# EAGLE schematic V3.1_Radio Stack Breakout System v40 (EAGLE 9.7.0)
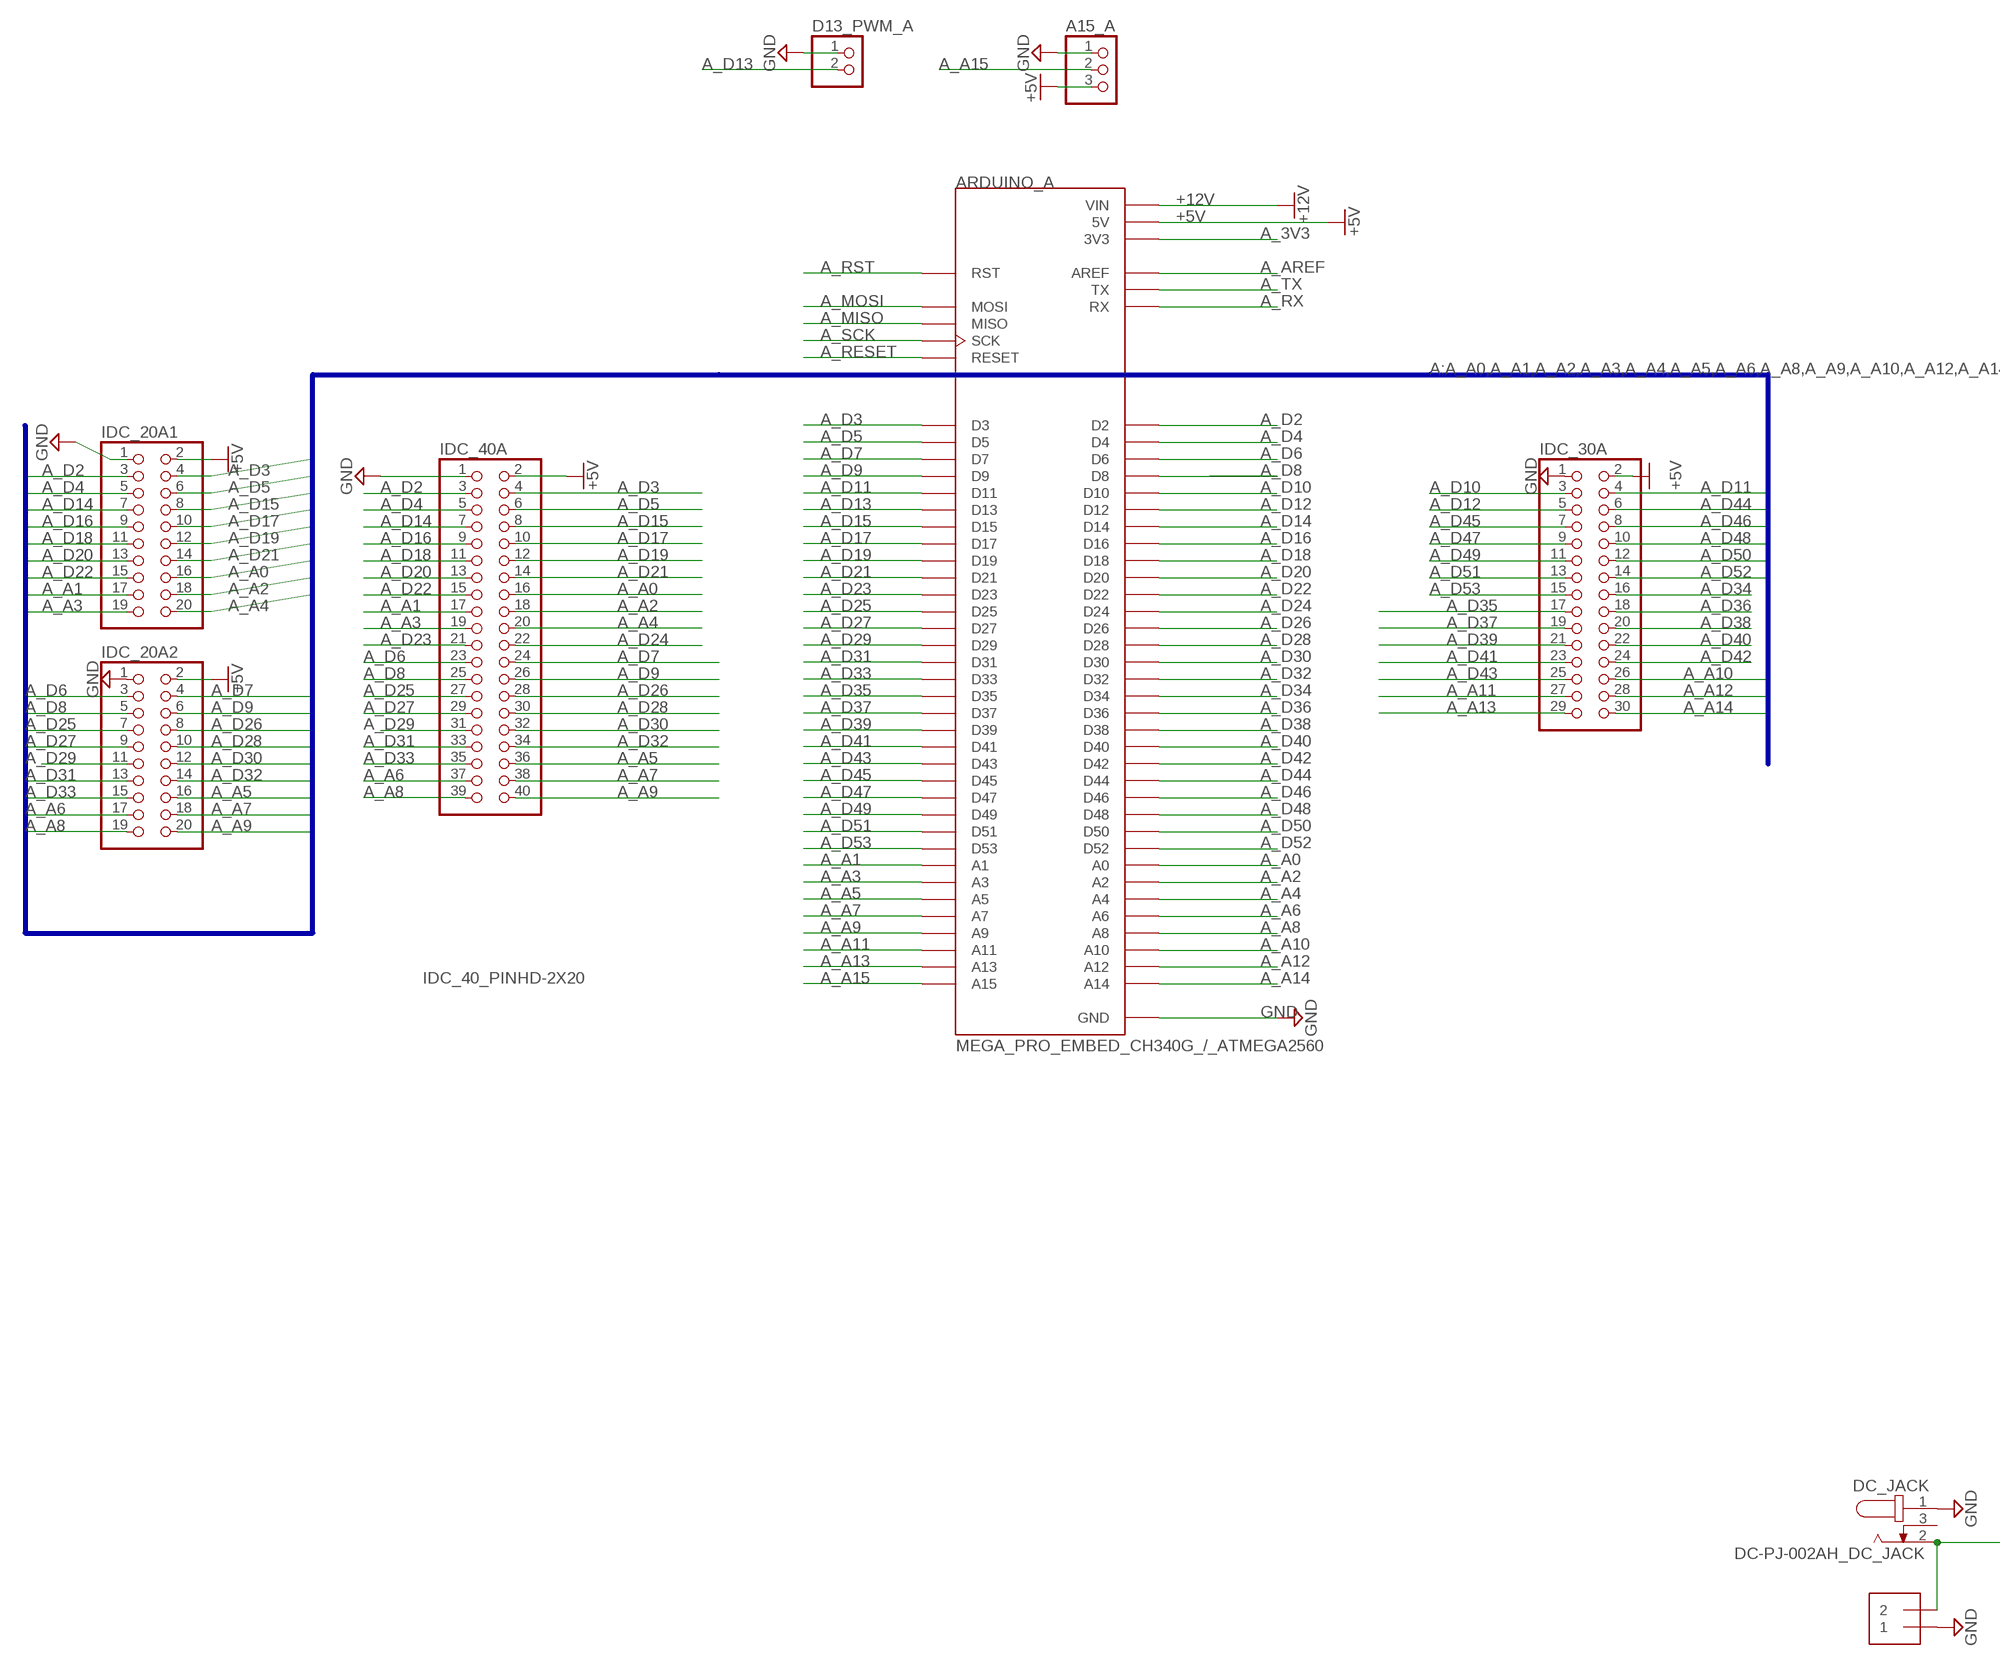
[diagram p0: schematic, sheet 1, part 1 of 2]
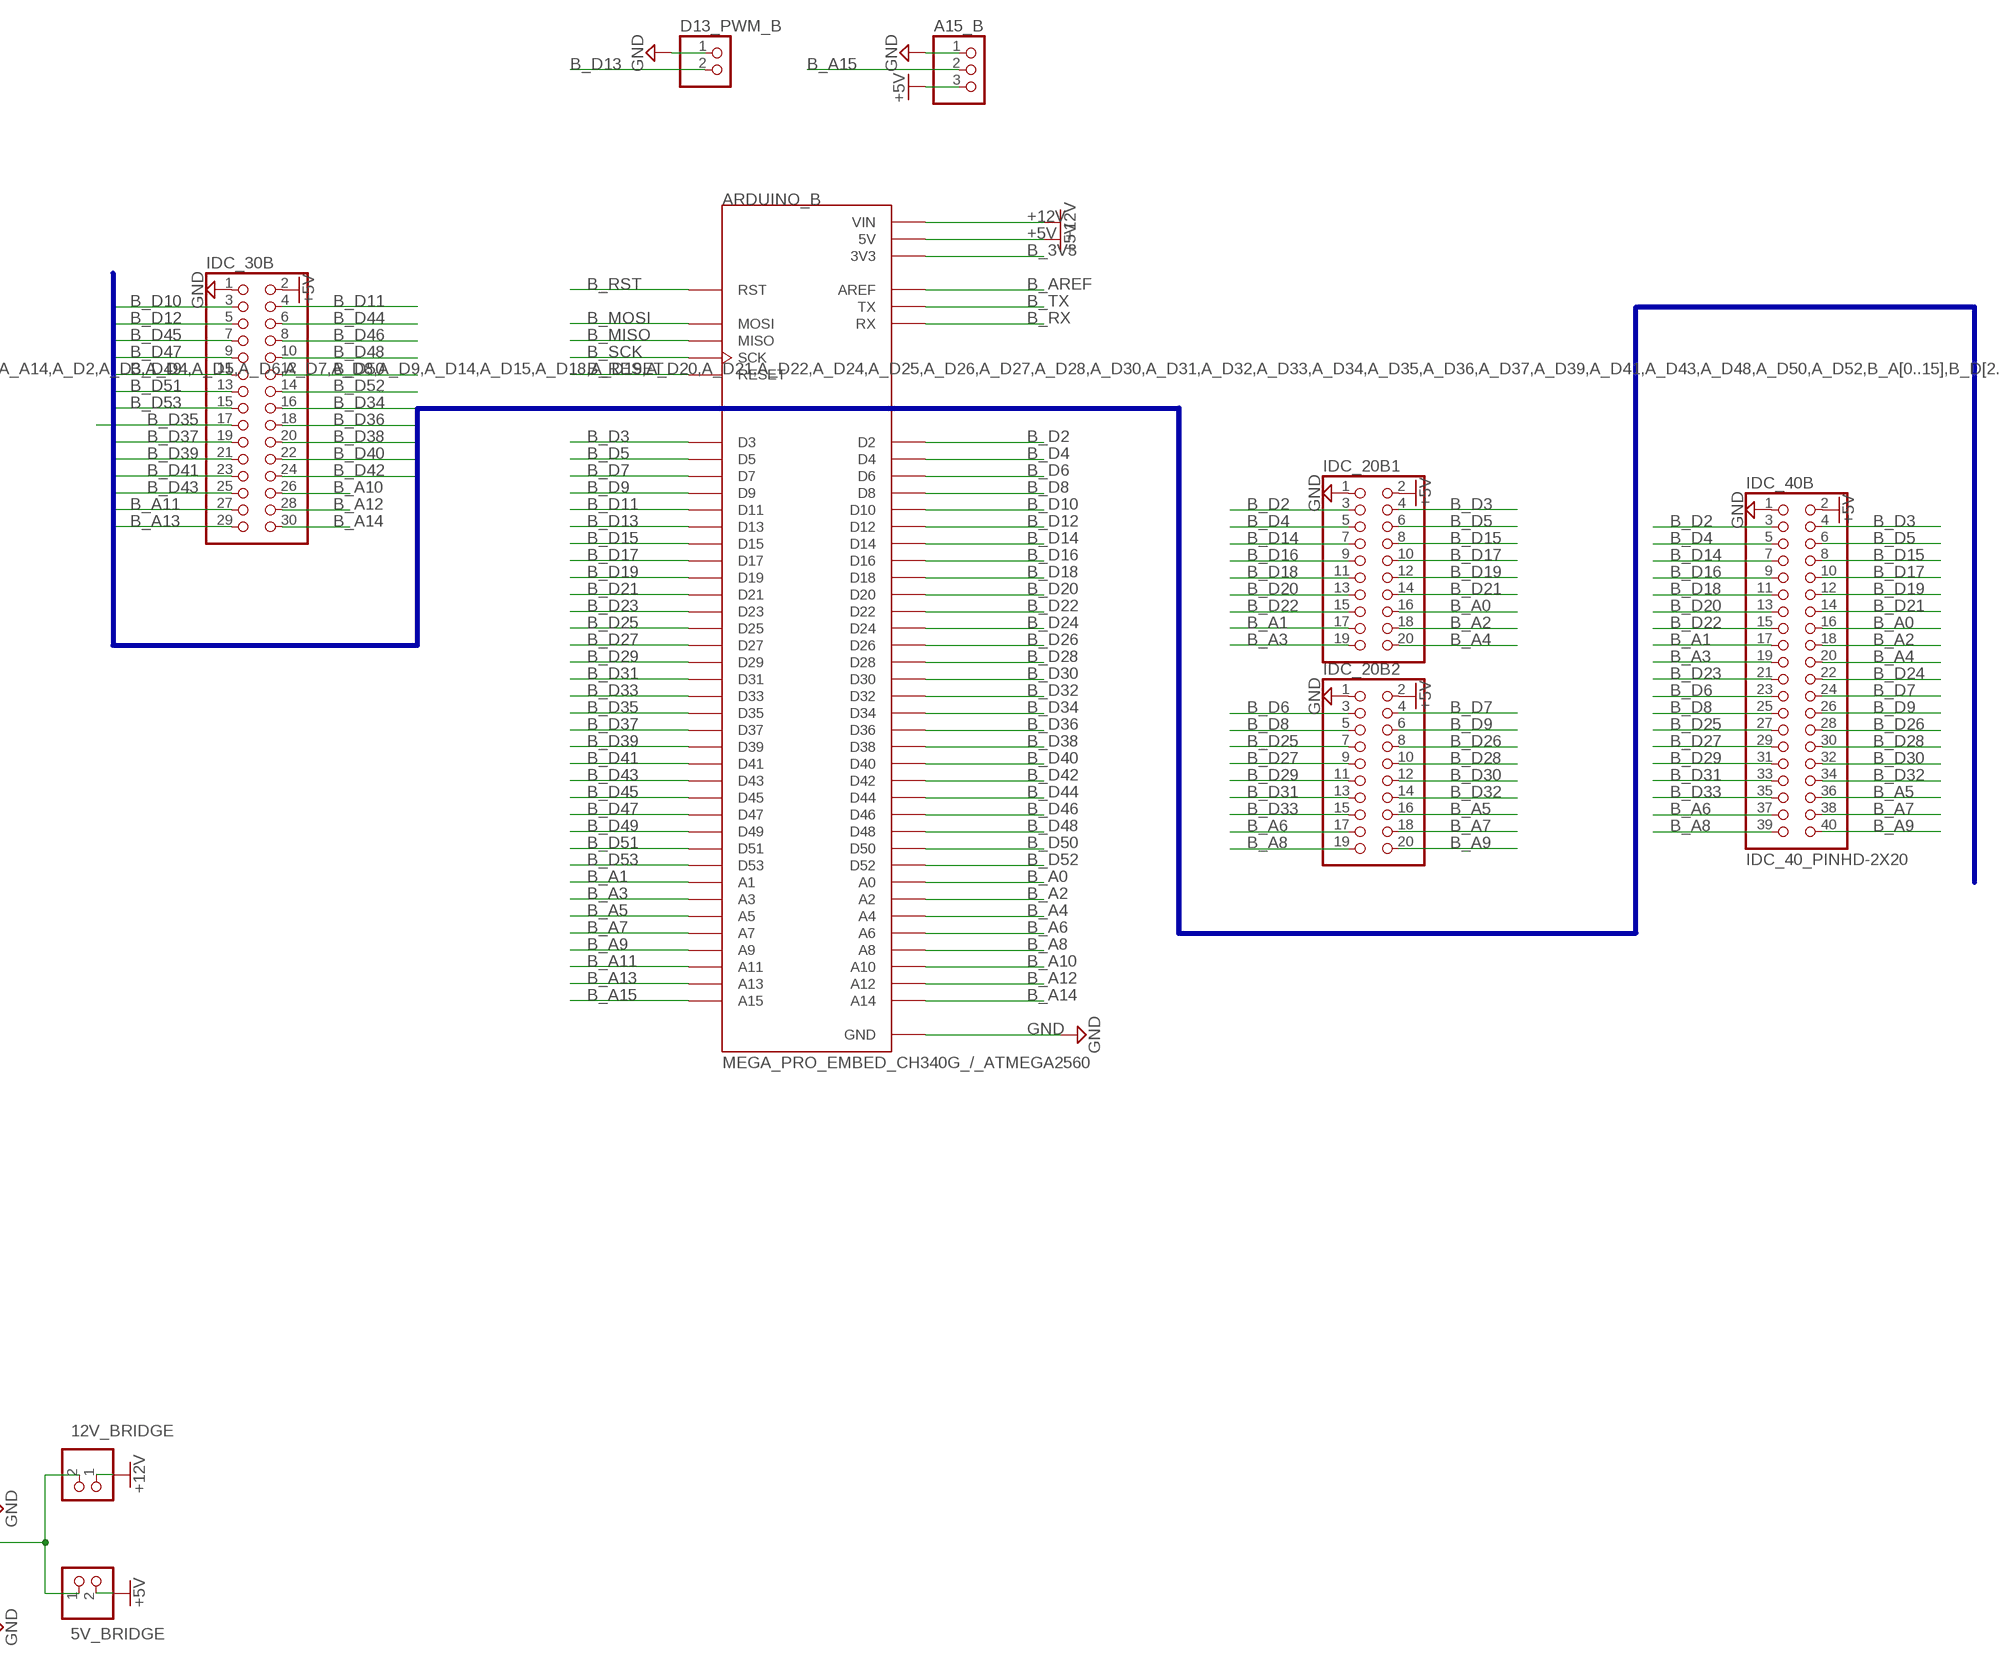
[diagram p1: schematic, sheet 1, part 2 of 2]

## Parts
5V_BRIDGE  PINHD-1X2  [1X02]
12V_BRIDGE  PINHD-1X2  [1X02]
A15_A  PINHD-1X3  [1X03]
A15_B  PINHD-1X3  [1X03]
ARDUINO_A  MEGA_PRO_EMBED_CH340G_/_ATMEGA2560  [MODULE_MEGA_PRO_EMBED_CH340G_/_ATMEGA2560]
ARDUINO_B  MEGA_PRO_EMBED_CH340G_/_ATMEGA2560  [MODULE_MEGA_PRO_EMBED_CH340G_/_ATMEGA2560]
D13_PWM_A  PINHD-1X2  [1X02]
D13_PWM_B  PINHD-1X2  [1X02]
DC_JACK  DC-PJ-002AH_DC_JACK  [CUI_PJ-002AH]
IDC_20A1  IDC_20_PINHD-2X10  [2X10]
IDC_20A2  IDC_20_PINHD-2X10  [2X10]
IDC_20B1  IDC_20_PINHD-2X10  [2X10]
IDC_20B2  IDC_20_PINHD-2X10  [2X10]
IDC_30A  IDC_30_PINHD-2X15  [2X15_IDC_30]
IDC_30B  IDC_30_PINHD-2X15  [2X15_IDC_30]
IDC_40A  IDC_40_PINHD-2X20  [IDC_40_2X20]
IDC_40B  IDC_40_PINHD-2X20  [IDC_40_2X20]
POWER  2.54MMAND5.08MM_SCREW_TERMINAL2.54&5.08  [1X2_2.54&5.08MM]

## Nets
+5V: 5V_BRIDGE.2 A15_A.3 A15_B.3 ARDUINO_A.5V_1(5V) ARDUINO_A.5V_2(5V) ARDUINO_A.5V_3(5V) ARDUINO_B.5V_1(5V) ARDUINO_B.5V_2(5V) ARDUINO_B.5V_3(5V) IDC_20A1.2 IDC_20A2.2 IDC_20B1.2 IDC_20B2.2 IDC_30A.2 IDC_30B.2 IDC_40A.2 IDC_40B.2
+12V: 12V_BRIDGE.1 ARDUINO_A.VIN_1(VIN) ARDUINO_A.VIN_2(VIN) ARDUINO_B.VIN_1(VIN) ARDUINO_B.VIN_2(VIN)
A_3V3: ARDUINO_A.3V3_1(3V3) ARDUINO_A.3V3_2(3V3)
A_A0: ARDUINO_A.A0 IDC_20A1.16 IDC_40A.16
A_A1: ARDUINO_A.A1 IDC_20A1.17 IDC_40A.17
A_A2: ARDUINO_A.A2 IDC_20A1.18 IDC_40A.18
A_A3: ARDUINO_A.A3 IDC_20A1.19 IDC_40A.19
A_A4: ARDUINO_A.A4 IDC_20A1.20 IDC_40A.20
A_A5: ARDUINO_A.A5 IDC_20A2.16 IDC_40A.36
A_A6: ARDUINO_A.A6 IDC_20A2.17 IDC_40A.37
A_A7: ARDUINO_A.A7 IDC_20A2.18 IDC_40A.38
A_A8: ARDUINO_A.A8 IDC_20A2.19 IDC_40A.39
A_A9: ARDUINO_A.A9 IDC_20A2.20 IDC_40A.40
A_A10: ARDUINO_A.A10 IDC_30A.26
A_A11: ARDUINO_A.A11 IDC_30A.27
A_A12: ARDUINO_A.A12 IDC_30A.28
A_A13: ARDUINO_A.A13 IDC_30A.29
A_A14: ARDUINO_A.A14 IDC_30A.30
A_A15: A15_A.2 ARDUINO_A.A15
A_AREF: ARDUINO_A.AREF
A_D2: ARDUINO_A.D2 IDC_20A1.3 IDC_40A.3
A_D3: ARDUINO_A.D3 IDC_20A1.4 IDC_40A.4
A_D4: ARDUINO_A.D4 IDC_20A1.5 IDC_40A.5
A_D5: ARDUINO_A.D5 IDC_20A1.6 IDC_40A.6
A_D6: ARDUINO_A.D6 IDC_20A2.3 IDC_40A.23
A_D7: ARDUINO_A.D7 IDC_20A2.4 IDC_40A.24
A_D8: ARDUINO_A.D8 IDC_20A2.5 IDC_40A.25
A_D9: ARDUINO_A.D9 IDC_20A2.6 IDC_40A.26
A_D10: ARDUINO_A.D10 IDC_30A.3
A_D11: ARDUINO_A.D11 IDC_30A.4
A_D12: ARDUINO_A.D12 IDC_30A.5
A_D13: ARDUINO_A.D13 D13_PWM_A.2
A_D14: ARDUINO_A.D14 IDC_20A1.7 IDC_40A.7
A_D15: ARDUINO_A.D15 IDC_20A1.8 IDC_40A.8
A_D16: ARDUINO_A.D16 IDC_20A1.9 IDC_40A.9
A_D17: ARDUINO_A.D17 IDC_20A1.10 IDC_40A.10
A_D18: ARDUINO_A.D18 IDC_20A1.11 IDC_40A.11
A_D19: ARDUINO_A.D19 IDC_20A1.12 IDC_40A.12
A_D20: ARDUINO_A.D20 IDC_20A1.13 IDC_40A.13
A_D21: ARDUINO_A.D21 IDC_20A1.14 IDC_40A.14
A_D22: ARDUINO_A.D22 IDC_20A1.15 IDC_40A.15
A_D23: ARDUINO_A.D23 IDC_40A.21
A_D24: ARDUINO_A.D24 IDC_40A.22
A_D25: ARDUINO_A.D25 IDC_20A2.7 IDC_40A.27
A_D26: ARDUINO_A.D26 IDC_20A2.8 IDC_40A.28
A_D27: ARDUINO_A.D27 IDC_20A2.9 IDC_40A.29
A_D28: ARDUINO_A.D28 IDC_20A2.10 IDC_40A.30
A_D29: ARDUINO_A.D29 IDC_20A2.11 IDC_40A.31
A_D30: ARDUINO_A.D30 IDC_20A2.12 IDC_40A.32
A_D31: ARDUINO_A.D31 IDC_20A2.13 IDC_40A.33
A_D32: ARDUINO_A.D32 IDC_20A2.14 IDC_40A.34
A_D33: ARDUINO_A.D33 IDC_20A2.15 IDC_40A.35
A_D34: ARDUINO_A.D34 IDC_30A.16
A_D35: ARDUINO_A.D35 IDC_30A.17
A_D36: ARDUINO_A.D36 IDC_30A.18
A_D37: ARDUINO_A.D37 IDC_30A.19
A_D38: ARDUINO_A.D38 IDC_30A.20
A_D39: ARDUINO_A.D39 IDC_30A.21
A_D40: ARDUINO_A.D40 IDC_30A.22
A_D41: ARDUINO_A.D41 IDC_30A.23
A_D42: ARDUINO_A.D42 IDC_30A.24
A_D43: ARDUINO_A.D43 IDC_30A.25
A_D44: ARDUINO_A.D44 IDC_30A.6
A_D45: ARDUINO_A.D45 IDC_30A.7
A_D46: ARDUINO_A.D46 IDC_30A.8
A_D47: ARDUINO_A.D47 IDC_30A.9
A_D48: ARDUINO_A.D48 IDC_30A.10
A_D49: ARDUINO_A.D49 IDC_30A.11
A_D50: ARDUINO_A.D50 IDC_30A.12
A_D51: ARDUINO_A.D51 IDC_30A.13
A_D52: ARDUINO_A.D52 IDC_30A.14
A_D53: ARDUINO_A.D53 IDC_30A.15
A_MISO: ARDUINO_A.MISO
A_MOSI: ARDUINO_A.MOSI
A_RESET: ARDUINO_A.RESET
A_RST: ARDUINO_A.RST
A_RX: ARDUINO_A.RX
A_SCK: ARDUINO_A.SCK
A_TX: ARDUINO_A.TX
B_3V3: ARDUINO_B.3V3_1(3V3) ARDUINO_B.3V3_2(3V3)
B_A0: ARDUINO_B.A0 IDC_20B1.16 IDC_40B.16
B_A1: ARDUINO_B.A1 IDC_20B1.17 IDC_40B.17
B_A2: ARDUINO_B.A2 IDC_20B1.18 IDC_40B.18
B_A3: ARDUINO_B.A3 IDC_20B1.19 IDC_40B.19
B_A4: ARDUINO_B.A4 IDC_20B1.20 IDC_40B.20
B_A5: ARDUINO_B.A5 IDC_20B2.16 IDC_40B.36
B_A6: ARDUINO_B.A6 IDC_20B2.17 IDC_40B.37
B_A7: ARDUINO_B.A7 IDC_20B2.18 IDC_40B.38
B_A8: ARDUINO_B.A8 IDC_20B2.19 IDC_40B.39
B_A9: ARDUINO_B.A9 IDC_20B2.20 IDC_40B.40
B_A10: ARDUINO_B.A10 IDC_30B.26
B_A11: ARDUINO_B.A11 IDC_30B.27
B_A12: ARDUINO_B.A12 IDC_30B.28
B_A13: ARDUINO_B.A13 IDC_30B.29
B_A14: ARDUINO_B.A14 IDC_30B.30
B_A15: A15_B.2 ARDUINO_B.A15
B_AREF: ARDUINO_B.AREF
B_D2: ARDUINO_B.D2 IDC_20B1.3 IDC_40B.3
B_D3: ARDUINO_B.D3 IDC_20B1.4 IDC_40B.4
B_D4: ARDUINO_B.D4 IDC_20B1.5 IDC_40B.5
B_D5: ARDUINO_B.D5 IDC_20B1.6 IDC_40B.6
B_D6: ARDUINO_B.D6 IDC_20B2.3 IDC_40B.23
B_D7: ARDUINO_B.D7 IDC_20B2.4 IDC_40B.24
B_D8: ARDUINO_B.D8 IDC_20B2.5 IDC_40B.25
B_D9: ARDUINO_B.D9 IDC_20B2.6 IDC_40B.26
B_D10: ARDUINO_B.D10 IDC_30B.3
B_D11: ARDUINO_B.D11 IDC_30B.4
B_D12: ARDUINO_B.D12 IDC_30B.5
B_D13: ARDUINO_B.D13 D13_PWM_B.2
B_D14: ARDUINO_B.D14 IDC_20B1.7 IDC_40B.7
B_D15: ARDUINO_B.D15 IDC_20B1.8 IDC_40B.8
B_D16: ARDUINO_B.D16 IDC_20B1.9 IDC_40B.9
B_D17: ARDUINO_B.D17 IDC_20B1.10 IDC_40B.10
B_D18: ARDUINO_B.D18 IDC_20B1.11 IDC_40B.11
B_D19: ARDUINO_B.D19 IDC_20B1.12 IDC_40B.12
B_D20: ARDUINO_B.D20 IDC_20B1.13 IDC_40B.13
B_D21: ARDUINO_B.D21 IDC_20B1.14 IDC_40B.14
B_D22: ARDUINO_B.D22 IDC_20B1.15 IDC_40B.15
B_D23: ARDUINO_B.D23 IDC_40B.21
B_D24: ARDUINO_B.D24 IDC_40B.22
B_D25: ARDUINO_B.D25 IDC_20B2.7 IDC_40B.27
B_D26: ARDUINO_B.D26 IDC_20B2.8 IDC_40B.28
B_D27: ARDUINO_B.D27 IDC_20B2.9 IDC_40B.29
B_D28: ARDUINO_B.D28 IDC_20B2.10 IDC_40B.30
B_D29: ARDUINO_B.D29 IDC_20B2.11 IDC_40B.31
B_D30: ARDUINO_B.D30 IDC_20B2.12 IDC_40B.32
B_D31: ARDUINO_B.D31 IDC_20B2.13 IDC_40B.33
B_D32: ARDUINO_B.D32 IDC_20B2.14 IDC_40B.34
B_D33: ARDUINO_B.D33 IDC_20B2.15 IDC_40B.35
B_D34: ARDUINO_B.D34 IDC_30B.16
B_D35: ARDUINO_B.D35 IDC_30B.17
B_D36: ARDUINO_B.D36 IDC_30B.18
B_D37: ARDUINO_B.D37 IDC_30B.19
B_D38: ARDUINO_B.D38 IDC_30B.20
B_D39: ARDUINO_B.D39 IDC_30B.21
B_D40: ARDUINO_B.D40 IDC_30B.22
B_D41: ARDUINO_B.D41 IDC_30B.23
B_D42: ARDUINO_B.D42 IDC_30B.24
B_D43: ARDUINO_B.D43 IDC_30B.25
B_D44: ARDUINO_B.D44 IDC_30B.6
B_D45: ARDUINO_B.D45 IDC_30B.7
B_D46: ARDUINO_B.D46 IDC_30B.8
B_D47: ARDUINO_B.D47 IDC_30B.9
B_D48: ARDUINO_B.D48 IDC_30B.10
B_D49: ARDUINO_B.D49 IDC_30B.11
B_D50: ARDUINO_B.D50 IDC_30B.12
B_D51: ARDUINO_B.D51 IDC_30B.13
B_D52: ARDUINO_B.D52 IDC_30B.14
B_D53: ARDUINO_B.D53 IDC_30B.15
B_MISO: ARDUINO_B.MISO
B_MOSI: ARDUINO_B.MOSI
B_RESET: ARDUINO_B.RESET
B_RST: ARDUINO_B.RST
B_RX: ARDUINO_B.RX
B_SCK: ARDUINO_B.SCK
B_TX: ARDUINO_B.TX
GND: A15_A.1 A15_B.1 ARDUINO_A.GND_1(GND) ARDUINO_A.GND_2(GND) ARDUINO_A.GND_3(GND) ARDUINO_B.GND_1(GND) ARDUINO_B.GND_2(GND) ARDUINO_B.GND_3(GND) D13_PWM_A.1 D13_PWM_B.1 DC_JACK.1 IDC_20A1.1 IDC_20A2.1 IDC_20B1.1 IDC_20B2.1 IDC_30A.1 IDC_30B.1 IDC_40A.1 IDC_40B.1 POWER.1 POWER.P$1
N$2: 5V_BRIDGE.1 12V_BRIDGE.2 DC_JACK.2 POWER.2 POWER.P$2
Unconnected: DC_JACK.3

## Buses
A:A_A0,A_A1,A_A2,A_A3,A_A4,A_A5,A_A6,A_A8,A_A9,A_A10,A_A12,A_A14,A_D2,A_D3,A_D4,A_D5,A_D6,A_D7,A_D8,A_D9,A_D14,A_D15,A_D18,A_D19,A_D20,A_D21,A_D22,A_D24,A_D25,A_D26,A_D27,A_D28,A_D30,A_D31,A_D32,A_D33,A_D34,A_D35,A_D36,A_D37,A_D39,A_D41,A_D43,A_D48,A_D50,A_D52,B_A[0..15],B_D[2..53]

## Library data of the parts
5V_BRIDGE 12V_BRIDGE D13_PWM_A D13_PWM_B = pinhead:PINHD-1X2: PIN HEADER
A15_A A15_B = pinhead:PINHD-1X3: PIN HEADER
ARDUINO_A ARDUINO_B = SnapEDA Library:MEGA_PRO_EMBED_CH340G_/_ATMEGA2560: Mega 2560 PRO (Embed) CH340G/ATmega2560-16AU; MANUFACTURER: Robotdyn; PARTREV: 12/May/2017; STANDARD: Manufacturer Recommendations
DC_JACK = CaptainBobSim Library, custom:DC-PJ-002AH_DC_JACK: 2.0 mm Center Pin, 5.0 A, Right Angle, Through Hole, Dc Power Jack Connector; MANUFACTURER: CUI INC; STANDARD: Manufacturer recommendations
IDC_20A1 IDC_20A2 IDC_20B1 IDC_20B2 = CaptainBobSim Library, custom:IDC_20_PINHD-2X10: PIN HEADER
IDC_30A IDC_30B = CaptainBobSim Library, custom:IDC_30_PINHD-2X15: PIN HEADER
IDC_40A IDC_40B = CaptainBobSim Library, custom:IDC_40_PINHD-2X20: PIN HEADER; CATEGORY: Headers; DESCRIPTION: Header, Straight, 2x20 Position; MANUFACTURER: Generic; MPN: Generic; OPERATING_TEMPERATURE: Generic; PART_STATUS: Active; PITCH: 0.100" (2.54mm); ROHS_COMPLIANCE: Generic; SERIES: Generic; SUB-CATEGORY: Headers, Male Pins; TYPE: Board to Board or Cable, Unshrouded, Through Hole, Straight
POWER = CaptainBobSim Library, custom:2.54MMAND5.08MM_SCREW_TERMINAL: 3.5mm Terminal block http://www.ladyada.net/library/pcb/eaglelibrary.html